# EAGLE schematic SerLCD_16x4_pb-v01 (EAGLE 7.6.0)
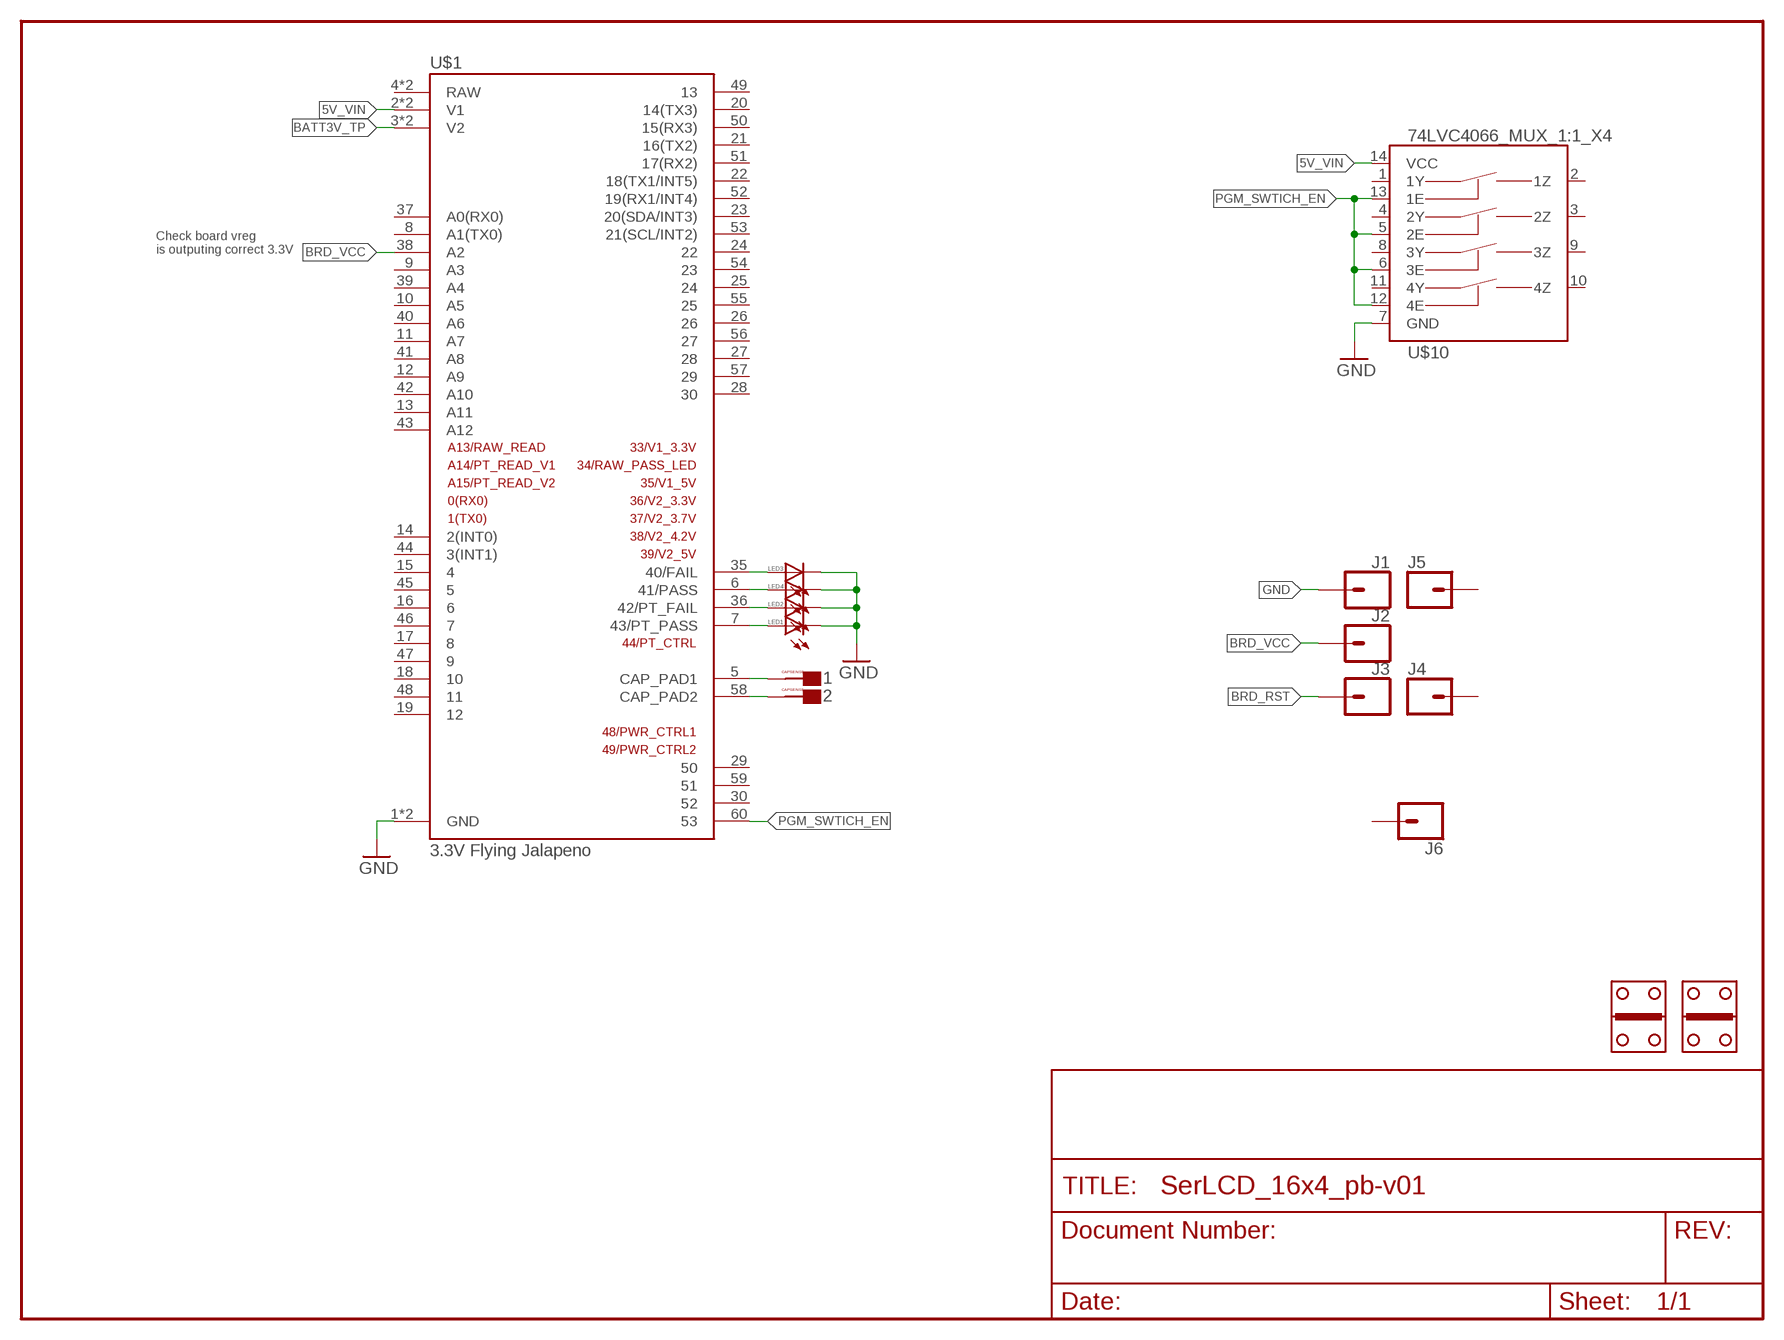
[diagram p0: schematic, sheet 1]

## Parts
1  CAPSENSE_BUTTON_PAD_ONLY  [CAPSENSE_BUTTON_PADS_ONLY]
2  CAPSENSE_BUTTON_PAD_ONLY  [CAPSENSE_BUTTON_PADS_ONLY]
J1  CONN_01OFFSET  [1X01_OFFSET]
J2  CONN_01OFFSET  [1X01_OFFSET]
J3  CONN_01OFFSET  [1X01_OFFSET]
J4  CONN_01OFFSET  [1X01_OFFSET]
J5  CONN_01OFFSET  [1X01_OFFSET]
J6  CONN_01OFFSET  [1X01_OFFSET]
LED1  LED1206  [LED-1206]
LED2  LED1206  [LED-1206]
LED3  LED1206  [LED-1206]
LED4  LED1206  [LED-1206]
U$1  3.3V Flying Jalapeno  FLYING_JALAPENO_V2MALE  [FLYING_JALAPENO_V2_M]
U$6  GOLD_HINDGEPB  [GOLD_HINDGE]
U$7  GOLD_HINDGEPB  [GOLD_HINDGE]
U$10  74LVC4066_MUX_1:1_X4  [SO14]

## Nets
5V_VIN [twenty_mil]: U$1.2(V1) U$1.32(V1) U$10.14(VCC)
BATT3V_TP: U$1.3(V2) U$1.33(V2)
BRD_RST: J3.1
BRD_VCC: J2.1 U$1.38(A2)
GND [twelve_mil]: J1.1 LED1.C LED2.C LED3.C LED4.C U$1.1(GND) U$1.31(GND) U$10.7(GND)
N$1 [eight_mil]: 1.CAPSENSE_PAD(CAPSENSE) U$1.5(CAP_PAD1)
N$2: 2.CAPSENSE_PAD(CAPSENSE) U$1.58(CAP_PAD2)
N$3 [eight_mil]: LED1.A U$1.7(43/PT_PASS)
N$4 [eight_mil]: LED2.A U$1.36(42/PT_FAIL)
N$5: LED3.A U$1.35(40/FAIL)
N$6: LED4.A U$1.6(41/PASS)
PGM_SWTICH_EN: U$1.60 U$10.5(2E) U$10.6(3E) U$10.12(4E) U$10.13(1E)
Unconnected: J4.1 J5.1 J6.1 U$1.4(RAW) U$1.8(A1(TX0)) U$1.9(A3) U$1.10(A5) U$1.11(A7) U$1.12(A9) U$1.13(A11) U$1.14(2(INT0)) U$1.15 U$1.16 U$1.17 U$1.18 U$1.19 U$1.20(14(TX3)) U$1.21(16(TX2)) U$1.22(18(TX1/INT5)) U$1.23(20(SDA/INT3)) U$1.24 U$1.25 U$1.26 U$1.27 U$1.28 U$1.29 U$1.30 U$1.34(RAW) U$1.37(A0(RX0)) U$1.39(A4) U$1.40(A6) U$1.41(A8) U$1.42(A10) U$1.43(A12) U$1.44(3(INT1)) U$1.45 U$1.46 U$1.47 U$1.48 U$1.49 U$1.50(15(RX3)) U$1.51(17(RX2)) U$1.52(19(RX1/INT4)) U$1.53(21(SCL/INT2)) U$1.54 U$1.55 U$1.56 U$1.57 U$1.59 U$10.1(1Y) U$10.2(1Z) U$10.3(2Z) U$10.4(2Y) U$10.8(3Y) U$10.9(3Z) U$10.10(4Z) U$10.11(4Y)

## Notes on the sheet
- Check board vreg 
  is outputing correct 3.3V

## Library data of the parts
1 2 = Testing:CAPSENSE_BUTTON_PAD_ONLY
J1-J6 = SparkFun-Connectors:CONN_01: Single connection point. Often used as Generic Header-pin footprint for 0.1 inch spaced/style header connections On any of the 0.1 inch spaced packages, you can populate with these: Break Away Headers - Straight <https://www.sparkfun.com/products/116> (PRT-00116) Break Away Male Headers - Right Angle <https://www.sparkfun.com/products/553> (PRT-00553) Female Headers <https://www.sparkfun.com/products/115> (PRT-00115) Break Away Headers - Machine Pin <https://www.sparkfun.com/products/117> (PRT-00117) Break Away Female Headers - Swiss Machine Pin <https://www.sparkfun.com/products/743> (PRT-00743) This device is also useful as a general connection point to wire up your design to another part of your project. Our various solder wires solder well into these plated through hole pads. Hook-Up Wire - Assortment (Stranded, 22 AWG) <https://www.sparkfun.com/products/11375> (PRT-11375) Hook-Up Wire - Assortment (Solid Core, 22 AWG) <https://www.sparkfun.com/products/11367> (PRT-11367) View the entire wire category on our website here <https://www.sparkfun.com/categories/141> Special notes: SMTSO-256-ET is a "flush mount" nut for a 4-40 screw. We mostly use this on specialty testbeds; it is a nice way to connect hardware to your PCB at an adjustable hieght. Also note, the SNAP packages are for using a snappable style connector. We sell a baggie of snaps and they are also used on two LilyPad designs: Snap Assortment - 30 pack (male and female) <https://www.sparkfun.com/products/11347> (DEV-11347) LilyPad Arduino SimpleSnap <https://www.sparkfun.com/products/10941> (DEV-10941) LilyPad SimpleSnap Protoboard <https://www.sparkfun.com/products/10940> (DEV-10940)
LED1-LED4 = Testing:LED: LEDs Standard schematic elements and footprints for 5mm, 3mm, 1206, and 0603 sized LEDs. 5mm - Spark Fun Electronics SKU : COM-00529 (and others)
U$1 = Testing-8-24-15:FLYING_JALAPENO_V2
U$6 U$7 = Testing:GOLD_HINDGE
U$10 = Testing:74LVC4066_MUX_1:1_X4

## Net classes
1 vcc1: width 0.203 mm
3 VCC2: width 0.381 mm, drill 0.508 mm, clearance 0.254 mm to class 0
8 eight_mil: width 0.203 mm, clearance 0.127 mm
9 twelve_mil: width 0.305 mm, clearance 0.127 mm
10 twenty_mil: width 0.508 mm, clearance 0.127 mm
11 thirty_mil: width 0.762 mm, clearance 0.127 mm
13 20_mil: width 0.508 mm, drill 0.508 mm